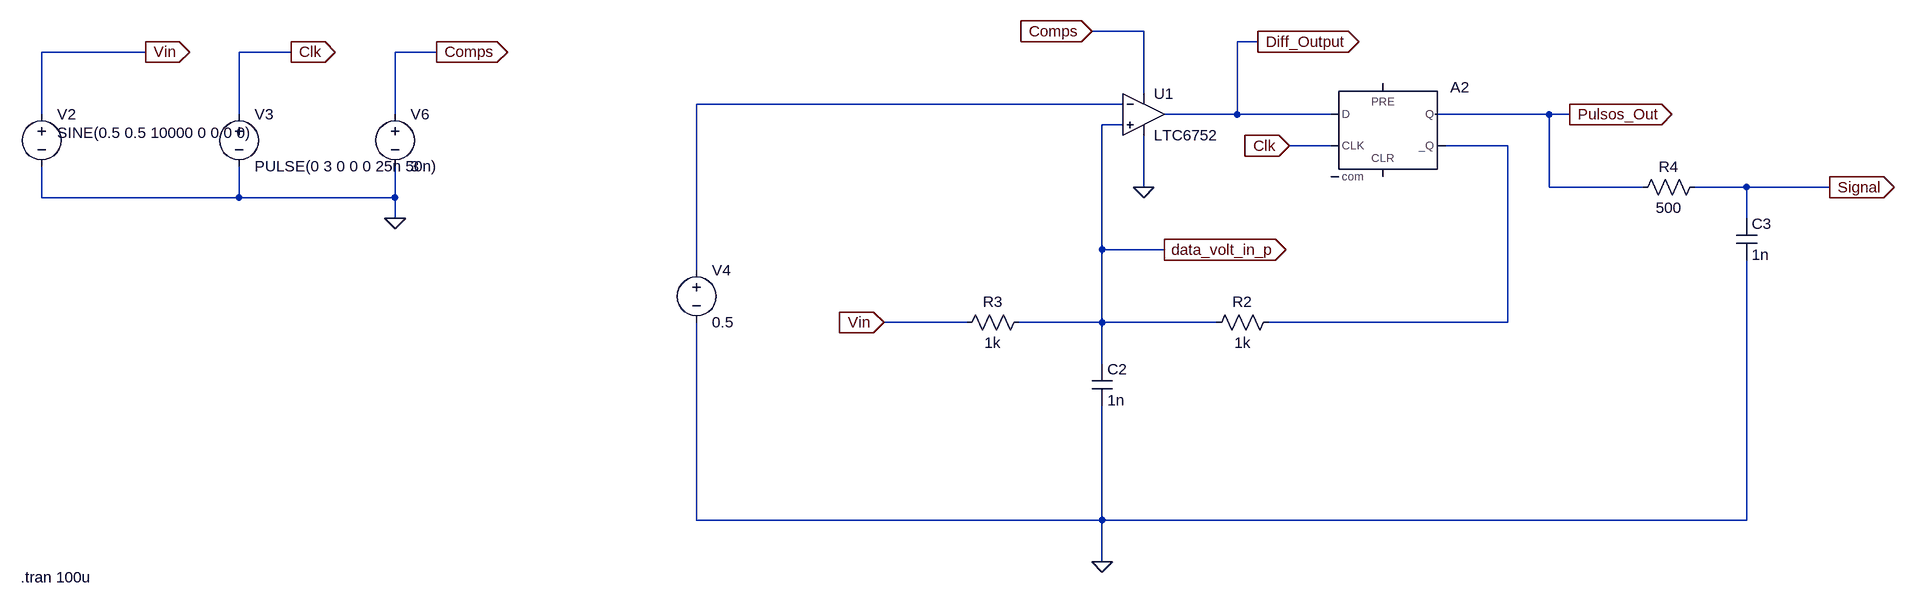
[diagram p0: schematic sigma delta.asc]
sigma delta.asc, the LTspice schematic file:
Version 4
SHEET 1 1336 2676
WIRE -112 880 -192 880
WIRE 64 896 32 896
WIRE -1648 912 -1808 912
WIRE -1424 912 -1504 912
WIRE -1200 912 -1264 912
WIRE -112 976 -112 880
WIRE -144 992 -800 992
WIRE -1808 1008 -1808 912
WIRE -1504 1008 -1504 912
WIRE -1264 1008 -1264 912
WIRE 32 1008 32 896
WIRE 32 1008 -80 1008
WIRE 176 1008 32 1008
WIRE 512 1008 336 1008
WIRE 544 1008 512 1008
WIRE -144 1024 -176 1024
WIRE 176 1056 112 1056
WIRE 448 1056 352 1056
WIRE -112 1120 -112 1040
WIRE 512 1120 512 1008
WIRE 656 1120 512 1120
WIRE 816 1120 736 1120
WIRE 944 1120 816 1120
WIRE -1808 1136 -1808 1088
WIRE -1504 1136 -1504 1088
WIRE -1504 1136 -1808 1136
WIRE -1264 1136 -1264 1088
WIRE -1264 1136 -1504 1136
WIRE -1264 1168 -1264 1136
WIRE 816 1168 816 1120
WIRE -176 1216 -176 1024
WIRE -80 1216 -176 1216
WIRE -800 1248 -800 992
WIRE -384 1328 -512 1328
WIRE -176 1328 -176 1216
WIRE -176 1328 -304 1328
WIRE 0 1328 -176 1328
WIRE 448 1328 448 1056
WIRE 448 1328 80 1328
WIRE -176 1392 -176 1328
WIRE -800 1632 -800 1328
WIRE -176 1632 -176 1456
WIRE -176 1632 -800 1632
WIRE 816 1632 816 1232
WIRE 816 1632 -176 1632
WIRE -176 1696 -176 1632
FLAG -176 1696 0
FLAG 544 1008 Pulsos_Out
IOPIN 544 1008 Out
FLAG -1200 912 Comps
IOPIN -1200 912 Out
FLAG -1264 1168 0
FLAG -192 880 Comps
IOPIN -192 880 In
FLAG -112 1120 0
FLAG -1424 912 Clk
IOPIN -1424 912 Out
FLAG 112 1056 Clk
IOPIN 112 1056 In
FLAG -1648 912 Vin
IOPIN -1648 912 Out
FLAG -512 1328 Vin
IOPIN -512 1328 In
FLAG 944 1120 Signal
IOPIN 944 1120 Out
FLAG -80 1216 data_volt_in_p
IOPIN -80 1216 Out
FLAG 64 896 Diff_Output
IOPIN 64 896 Out
SYMBOL voltage -1808 992 R0
WINDOW 123 0 0 Left 0
WINDOW 39 0 0 Left 0
WINDOW 3 24 44 Left 2
SYMATTR Value SINE(0.5 0.5 10000 0 0 0 0)
SYMATTR InstName V2
SYMBOL Digital\\dflop 256 960 R0
SYMATTR InstName A2
SYMBOL voltage -800 1232 R0
WINDOW 123 0 0 Left 0
WINDOW 39 0 0 Left 0
SYMATTR InstName V4
SYMATTR Value 0.5
SYMBOL Comparators\\LTC6752 -112 944 R0
SYMATTR InstName U1
SYMBOL res 96 1312 R90
WINDOW 0 0 56 VBottom 2
WINDOW 3 32 56 VTop 2
SYMATTR InstName R2
SYMATTR Value 1k
SYMBOL res -288 1312 R90
WINDOW 0 0 56 VBottom 2
WINDOW 3 32 56 VTop 2
SYMATTR InstName R3
SYMATTR Value 1k
SYMBOL cap -192 1392 R0
SYMATTR InstName C2
SYMATTR Value 1n
SYMBOL voltage -1264 992 R0
WINDOW 123 0 0 Left 0
WINDOW 39 0 0 Left 0
SYMATTR InstName V6
SYMATTR Value 3
SYMBOL voltage -1504 992 R0
WINDOW 123 0 0 Left 0
WINDOW 39 0 0 Left 0
SYMATTR InstName V3
SYMATTR Value PULSE(0 3 0 0 0 25n 50n)
SYMBOL res 752 1104 R90
WINDOW 0 0 56 VBottom 2
WINDOW 3 32 56 VTop 2
SYMATTR InstName R4
SYMATTR Value 500
SYMBOL cap 800 1168 R0
SYMATTR InstName C3
SYMATTR Value 1n
TEXT -1840 1720 Left 2 !.tran 100u

The netlist it stands for:
* sigma delta.asc
V2 Vin 0 SINE(0.5 0.5 10000 0 0 0 0)
A2 Diff_Output 0 Clk 0 0 N002 Pulsos_Out 0 DFLOP
V4 N001 0 0.5
XU1 data_volt_in_p N001 Comps 0 Diff_Output LTC6752  ; pins In+ In- V+ V- OUT
R2 N002 data_volt_in_p 1k
R3 data_volt_in_p Vin 1k
C2 data_volt_in_p 0 1n
V6 Comps 0 3
V3 Clk 0 PULSE(0 3 0 0 0 25n 50n)
R4 Signal Pulsos_Out 500
C3 Signal 0 1n
.tran 100u
.lib LTC7.lib
.backanno
.end